# EAGLE design ROwen_Power (EAGLE 7.2.0)
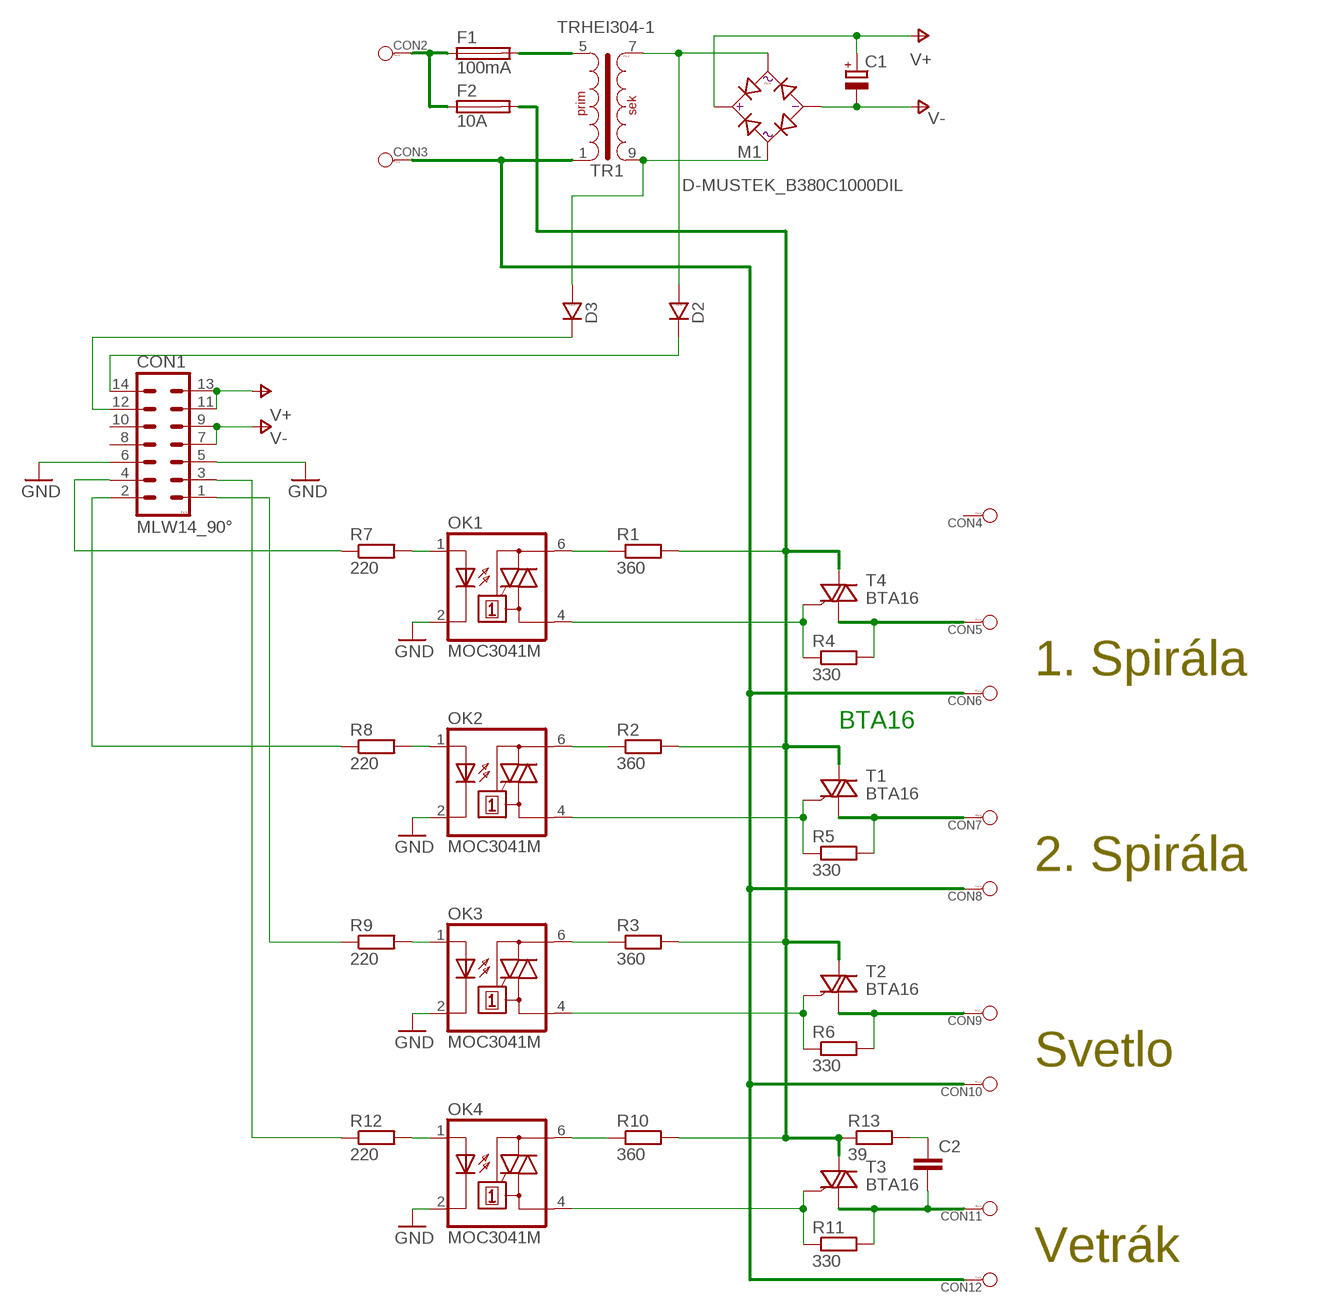
[diagram p0: schematic, sheet 1]

## Parts
C1  CPOL-EUE3.5-10  [E3,5-10]
C2  C-EU050-055X075  [C050-055X075]
CON1  MLW14_90°  [MLW14A]
CON2  WAGO256  [WAGO256]
CON3  WAGO256  [WAGO256]
CON4  WAGO256  [WAGO256]
CON5  WAGO256  [WAGO256]
CON6  WAGO256  [WAGO256]
CON7  WAGO256  [WAGO256]
CON8  WAGO256  [WAGO256]
CON9  WAGO256  [WAGO256]
CON10  WAGO256  [WAGO256]
CON11  WAGO256  [WAGO256]
CON12  WAGO256  [WAGO256]
D2  D_10  [DO41]
D3  D_10  [DO41]
F1  100mA  SH22,5A  [SH22,5A]
F2  10A  SH22,5A  [SH22,5A]
M1  D-MUSTEK_B380C1000DIL  [DM_DB1]
OK1  MOC3041M  [DIL06]
OK2  MOC3041M  [DIL06]
OK3  MOC3041M  [DIL06]
OK4  MOC3041M  [DIL06]
R1  360  R-EU_0207/10  [0207/10]
R2  360  R-EU_0207/10  [0207/10]
R3  360  R-EU_0207/10  [0207/10]
R4  330  R-EU_0207/10  [0207/10]
R5  330  R-EU_0207/10  [0207/10]
R6  330  R-EU_0207/10  [0207/10]
R7  220  R-EU_0207/10  [0207/10]
R8  220  R-EU_0207/10  [0207/10]
R9  220  R-EU_0207/10  [0207/10]
R10  360  R-EU_0207/10  [0207/10]
R11  330  R-EU_0207/10  [0207/10]
R12  220  R-EU_0207/10  [0207/10]
R13  39  R-EU_0309/12  [0309/12]
T1  BTA16  [TO220]
T2  BTA16  [TO220]
T3  BTA16  [TO220]
T4  BTA16  [TO220]
TR1  TRHEI304-1  [TRHEI304]

## Nets
GND: CON1.5 CON1.6 OK1.2(C) OK2.2(C) OK3.2(C) OK4.2(C)
N$1: CON1.1 R9.1
N$2 [AC]: OK1.6(A2) R1.1
N$3 [AC]: CON5.1 R4.2 T4.T1(A1)
N$4 [AC]: OK3.4(A1) R6.1 T2.G
N$5 [AC]: OK2.4(A1) R5.1 T1.G
N$6: OK3.1(A) R9.2
N$7 [AC]: OK3.6(A2) R3.1
N$8 [AC]: CON7.1 R5.2 T1.T1(A1)
N$9 [AC]: OK1.4(A1) R4.1 T4.G
N$10: CON1.4 R7.1
N$11 [AC]: OK2.6(A2) R2.1
N$12 [AC]: CON9.1 R6.2 T2.T1(A1)
N$13: F1.2 TR1.5(P2)
N$14: OK2.1(A) R8.2
N$15: OK1.1(A) R7.2
N$16: CON2.1 F1.1 F2.1
N$17: F2.2 R1.2 R2.2 R3.2 R10.2 R13.1 T1.T2(A2) T2.T2(A2) T3.T2(A2) T4.T2(A2)
N$18: D3.A M1.AC1 TR1.9(S2)
N$19 [AC]: CON3.1 CON6.1 CON8.1 CON10.1 CON12.1 TR1.1
N$20: D2.A M1.AC2 TR1.7(S1)
N$21: CON1.2 R8.1
N$22: C2.1 R13.2
N$23 [AC]: C2.2 CON11.1 R11.2 T3.T1(A1)
N$24 [AC]: OK4.4(A1) R11.1 T3.G
N$25: CON1.14 D2.K
N$26: CON1.12 D3.K
N$27 [AC]: OK4.6(A2) R10.1
N$28: OK4.1(A) R12.2
N$29: CON1.3 R12.1
V+: C1.+ CON1.11 CON1.13 M1.+
V-: C1.- CON1.7 CON1.9 M1.-
Unconnected: CON1.8 CON1.10 CON4.1

## Notes on the sheet
- 1. Spirála
- BTA16
- 2. Spirála
- Svetlo
- Vetrák

## Library data of the parts
C1 = resistor:CPOL-EU: POLARIZED CAPACITOR, European symbol
C2 = rcl:C-EU: CAPACITOR, European symbol
CON1 = #PaJa_konektory:MLW14: Konektory MLW - vidlice - 14x
CON2-CON12 = #PaJa_konektory:WAGO256: Konektor WAGO - RM 5,08mm - s packou
D2 D3 = #PaJa_30:D: Dioda - univerzální
F1 F2 = fuse:SH22,5A: FUSE HOLDER grid 22,5mm, isolated cap OGN0031 8201, Schurter (Buerklin); MPN: 0031.7701.11; OC_FARNELL: unknown; OC_NEWARK: 04F1224
M1 = #PaJa_30:D-MUSTEK: Diodovy mustek - Graetz
OK1-OK4 = optocoupler:MOC30*: 6-Pin DIP Zero-Cross Optoisolators Triac Driver Output (250/400 Volt Peak) Source: Data sheet <http://www.fairchildsemi.com/ds/MO/MOC3031M.pdf> The old path of data sheet not more available 2013-05-06.; MF: FAIRCHILD SEMICONDUCTOR; MPN: MOC3041M; OC_FARNELL: 1086677; OC_NEWARK: 78K6090
R1-R13 = resistor:R-EU_: RESISTOR, European symbol
T1-T4 = kumen:BTA16
TR1 = #PaJa_30:TRHEI304-1: Transformator - do DPS - 2,6 VA

## Net classes
1 AC: clearance 2.5 mm

## Board
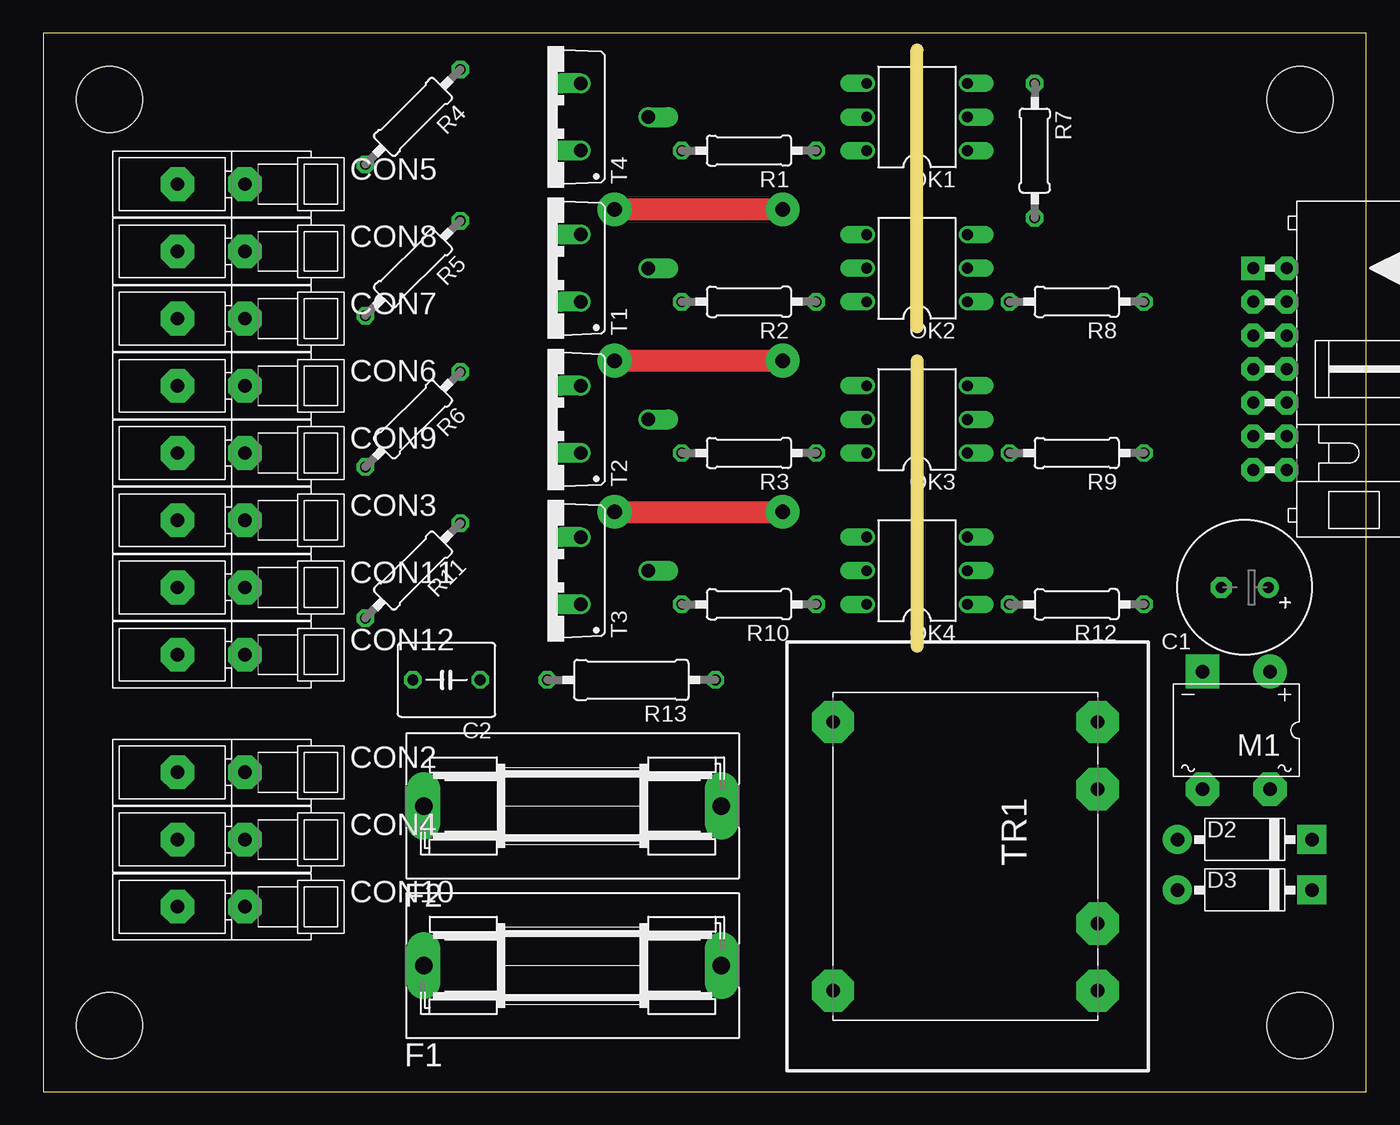
[diagram p1: board, top side]
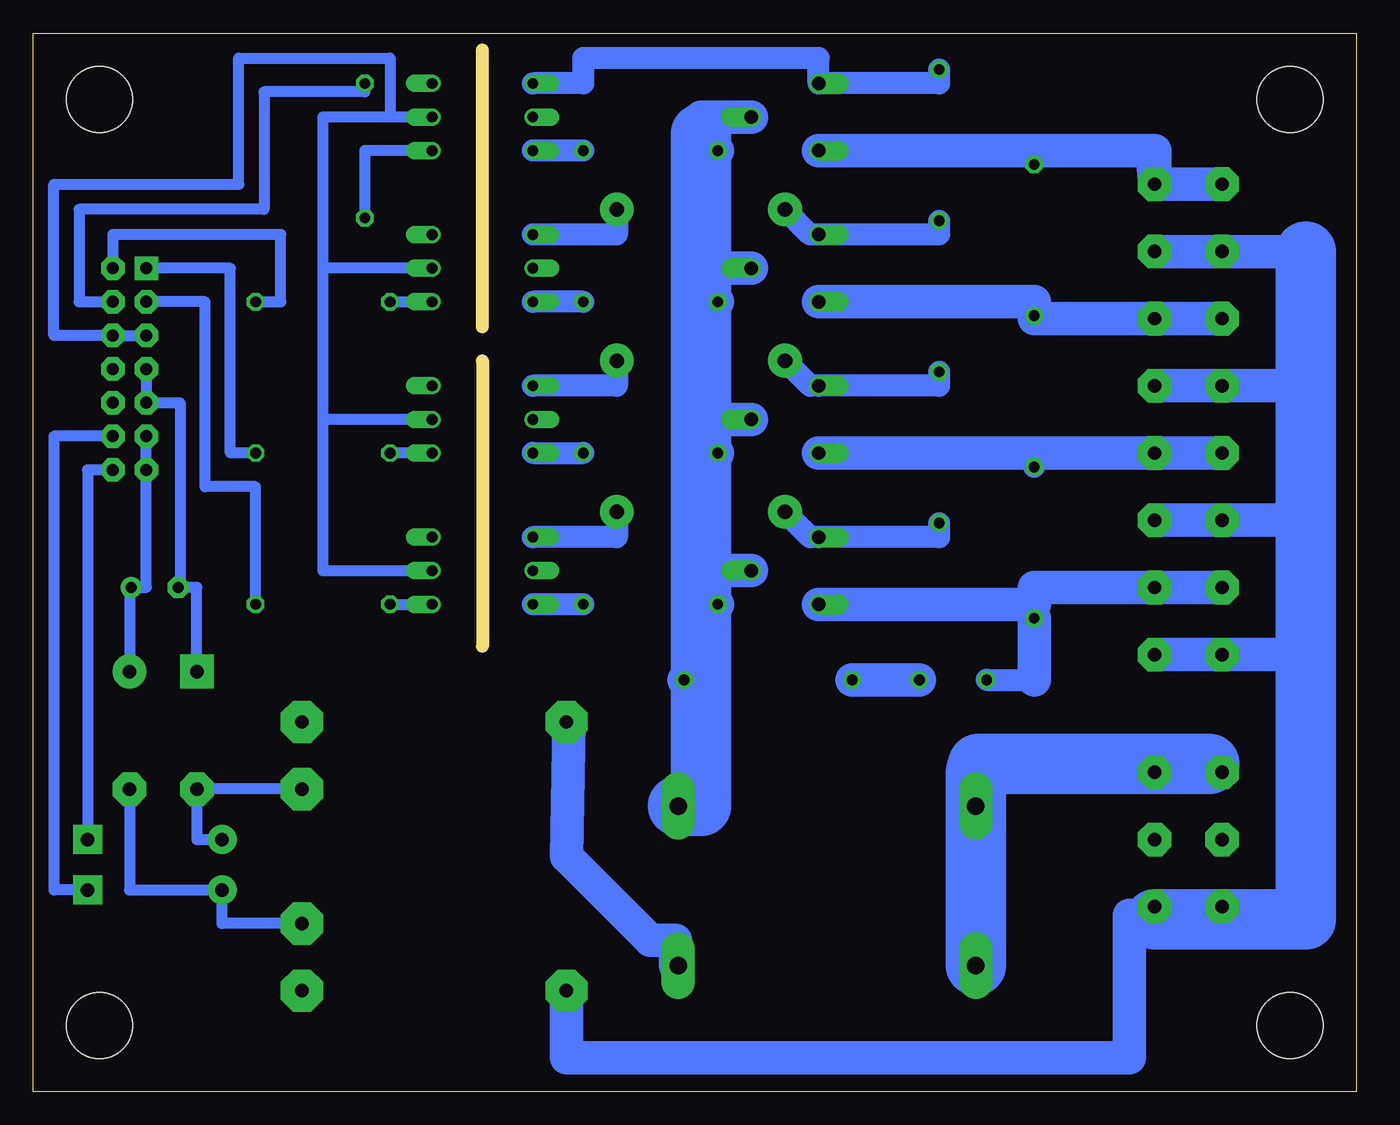
[diagram p2: board, bottom side, seen from below]

Size 100 x 80 mm. Coordinates in mm from the lower left corner, seen from the top.
Outline: 0,0 100,0 100,80 0,80 0,0
Copper layers (1*16): Top 0.035mm / dielectric 1.5mm / Bottom 0.035mm
Design rules "default": minimum track width 10mil, minimum drill 24mil, track to track 8mil, track to pad 8mil, pad to pad 8mil, via to via 8mil, smd to smd 8mil, copper to edge 40mil, drill to drill 8mil, minimum pad ring 10mil, minimum via ring 8mil, stop-mask expansion 4mil, vias tented up to drill 0mil, thermal gap 10mil
Holes 5 mm at 5,75 95,75 95,5 5,5
Milling: 2 lines

### Footprints (pad centres in the part's own frame; a part is rotated, then mirrored left to right if it is on the bottom)
E3,5-10 = drill 0.813 pad 1.6: + -1.778,0 | drill 0.813 pad 1.6 octagon: - 1.778,0
C050-055X075 = drill 0.813 octagon: 1 -2.54,0; 2 2.54,0
MLW14A = drill 0.914 pad 1.778 square: 1 -7.62,-1.27 | drill 0.914 pad 1.778 octagon: 2 -7.62,1.27; 3 -5.08,-1.27; 4 -5.08,1.27; 5 -2.54,-1.27; 6 -2.54,1.27; 7 0,-1.27; 8 0,1.27; 9 2.54,-1.27; 10 2.54,1.27; 11 5.08,-1.27; 12 5.08,1.27; 13 7.62,-1.27; 14 7.62,1.27
WAGO256 = drill 1.016 pad 2.54 octagon: 1 0,0; A1 -5.08,0
DO41 = drill 1.016 pad 2.184: A -5.08,0 | drill 1.016 pad 2.184 square: K 5.08,0
SH22,5A = drill 1.321 pad 2.54 long: 1 -11.252,0; 2 11.252,0
DM_DB1 = drill 1.016 pad 2.54: + -2.54,-4.445 | drill 1.016 pad 2.54 square: - 2.54,-4.445 | drill 1.016 pad 2.54 octagon: AC1 -2.54,4.445; AC2 2.54,4.445
DIL06 = drill 0.813 offset: 1 -2.54,-3.81; 2 0,-3.81; 3 2.54,-3.81; 4 2.54,3.81; 5 0,3.81; 6 -2.54,3.81
0207/10 = drill 0.813 octagon: 1 -5.08,0; 2 5.08,0
0309/12 = drill 0.813 octagon: 1 -6.35,0; 2 6.35,0
TO220 = drill 1.016 offset: G 2.54,-2.54; T1 -2.54,-2.54; T2 0,-7.62
TRHEI304 = drill 1.016 pad 3.2 octagon: 1 -10.16,10.16; 5 10.16,10.16; 6 10.16,-9.842; 7 5.08,-9.842; 9 -5.08,-9.842; 10 -10.16,-9.842

### Placement (x,y rotation side)
C1  90.81,38.1 180 top
C2  30.48,31.11 180 top
CON1  92.71,54.61 270 top
CON2  15.24,24.13 0 top
CON3  15.24,43.18 0 top
CON4  15.24,19.05 0 top
CON5  15.24,68.58 0 top
CON6  15.24,53.34 0 top
CON7  15.24,58.42 0 top
CON8  15.24,63.5 0 top
CON9  15.24,48.26 0 top
CON10  15.24,13.97 0 top
CON11  15.24,38.1 0 top
CON12  15.24,33.02 0 top
D2  90.81,19.05 0 top
D3  90.81,15.24 0 top
F1  40.01,9.53 0 top
F2  40.01,21.59 0 top
M1  90.17,27.3 180 top
OK1  66.04,73.66 90 top
OK2  66.04,62.23 90 top
OK3  66.04,50.8 90 top
OK4  66.04,39.37 90 top
R1  53.34,71.12 180 top
R2  53.34,59.69 180 top
R3  53.34,48.26 180 top
R4  27.94,73.66 225 top
R5  27.94,62.23 225 top
R6  27.94,50.8 225 top
R7  74.93,71.12 270 top
R8  78.11,59.69 180 top
R9  78.11,48.26 180 top
R10  53.34,36.83 180 top
R11  27.94,39.37 225 top
R12  78.11,36.83 180 top
R13  44.45,31.11 180 top
T1  38.1,62.23 90 top
T2  38.1,50.8 90 top
T3  38.1,39.37 90 top
T4  38.1,73.66 90 top
TR1  69.85,17.78 90 top

### Tracks (layer width: path | path; a pad name or v marks a point on that pad's centre or on a via)
GND
  Bottom 0.813: OK1.2 73.03,73.66 | 73.03,73.66 78.11,73.66 78.11,62.23 | 78.11,62.23 78.11,50.8 | 78.11,50.8 78.11,39.37 OK4.2 | OK3.2 78.11,50.8 | OK2.2 78.11,62.23 | 73.03,73.66 73.03,78.11 84.45,78.11 84.45,68.58 98.42,68.58 98.42,57.15 CON1.6 CON1.5
N$1
  Bottom 0.813: R9.1 85.09,48.26 85.09,62.23 CON1.1
N$2
  Bottom 1.676: R1.1 OK1.6
N$3
  Bottom 0.813: R4.2 24.13,70.07 24.13,71.12
  Bottom 2.54: CON5.1 15.46,71.12 | 15.46,71.12 24.13,71.12 T4.T1 | 15.46,71.12 15.24,71.12 CON5.1 | CON5.1 10.16,68.58
N$4  (via drill 1.1 pad 2.54)
  Top 1.676: v43.18,55.24 v55.88,55.24
  Bottom 1.676: R6.1 31.53,53.34 T2.G 41.27,53.34 v43.18,55.24 | v55.88,55.24 55.88,53.34 OK3.4
N$5  (via drill 1.1 pad 2.54)
  Top 1.676: v43.18,66.67 v55.88,66.67
  Bottom 1.676: R5.1 31.53,64.77 T1.G 41.27,64.77 v43.18,66.67 | v55.88,66.67 55.88,64.77 OK2.4
N$6
  Bottom 0.813: OK3.1 R9.2
N$7
  Bottom 1.676: OK3.6 R3.1
N$8
  Bottom 1.676: R5.2 24.35,59.69
  Bottom 2.54: T1.T1 24.35,59.69 24.35,58.42 CON7.1 10.16,58.42
N$9
  Bottom 1.676: R4.1 31.53,76.2 T4.G 40.64,78.11 58.42,78.11 58.42,76.2 OK1.4
N$10
  Bottom 0.813: R7.1 74.93,75.56 82.55,75.56 82.55,66.67 96.52,66.67 96.52,59.69 CON1.4
N$11
  Bottom 1.676: R2.1 OK2.6
N$12
  Bottom 1.676: R6.2 24.35,48.26
  Bottom 2.54: T2.T1 24.35,48.26 CON9.1 10.16,48.26
N$13
  Bottom 1.676: 59.51,27.94 TR1.5
  Bottom 2.54: F1.2 51.44,9.53 51.44,11.43 53.34,11.43 59.69,17.78 59.51,27.94
N$14
  Bottom 0.813: R8.2 OK2.1
N$15
  Bottom 0.813: OK1.1 74.93,71.12 R7.2
N$16
  Bottom 2.54: CON2.1 15.24,24.77
  Bottom 4.572: 11.11,24.77 15.24,24.77 28.57,24.77 28.75,24.13 F2.1 F1.1
N$17
  Bottom 2.54: T4.T2 49.53,73.66 49.53,71.12 R1.2 | T1.T2 49.53,62.23 | R2.2 49.53,59.69 | T2.T2 49.53,50.8 | R3.2 49.53,48.26 | T3.T2 49.53,39.37 | R10.2 49.53,36.83 | R13.1 49.53,30.48 49.53,33.02
  Bottom 4.572: F2.2 49.53,21.59 49.53,33.02 49.53,36.83 49.53,39.37 49.53,48.26 49.53,50.8 49.53,59.69 49.53,62.23 49.53,71.12 49.53,72.39
N$18
  Bottom 0.813: TR1.9 85.72,12.7 D3.A 92.71,15.24 M1.AC1
N$19
  Bottom 2.54: CON8.1 3.81,63.5 | 3.81,53.34 CON6.1 | CON3.1 3.81,43.18 | CON12.1 3.81,33.02 | TR1.1 59.69,2.54 17.14,2.54 17.14,13.34 15.24,13.34 | 15.24,13.02 15.24,13.34 | 15.24,13.34 CON10.1
  Bottom 4.572: 3.81,63.5 3.81,53.34 3.81,43.18 3.81,33.02 3.81,13.02 15.24,13.02
N$20
  Bottom 0.813: TR1.7 M1.AC2 87.63,19.05 D2.A
N$21
  Bottom 0.813: R8.1 81.28,59.69 81.28,64.77 93.98,64.77 CON1.2
N$22
  Bottom 2.54: C2.1 R13.2
N$23
  Bottom 1.676: R11.2 24.35,36.83 | C2.2 24.35,31.11
  Bottom 2.54: T3.T1 24.35,36.83 24.35,38.1 CON11.1 10.16,38.1 | 24.35,31.11 R11.2
N$24  (via drill 1.1 pad 2.54)
  Top 1.676: v43.18,43.81 v55.88,43.81
  Bottom 1.676: R11.1 31.53,41.91 T3.G 41.27,41.91 v43.18,43.81 | v55.88,43.81 55.88,41.91 OK4.4
N$25
  Bottom 0.813: CON1.14 95.89,46.99 D2.K
N$26
  Bottom 0.813: CON1.12 98.42,49.53 98.42,15.24 D3.K
N$27
  Bottom 1.676: R10.1 OK4.6
N$28
  Bottom 0.813: R12.2 OK4.1
N$29
  Bottom 0.813: CON1.3 87,59.69 87,45.72 83.19,45.72 R12.1
V+
  Bottom 0.813: CON1.11 CON1.13 91.44,38.1 C1.+ 92.71,38.1 M1.+
V-
  Bottom 0.813: CON1.7 CON1.9 88.9,52.07 88.9,38.1 | M1.- 87.63,38.1 88.9,38.1 | 88.9,38.1 C1.-